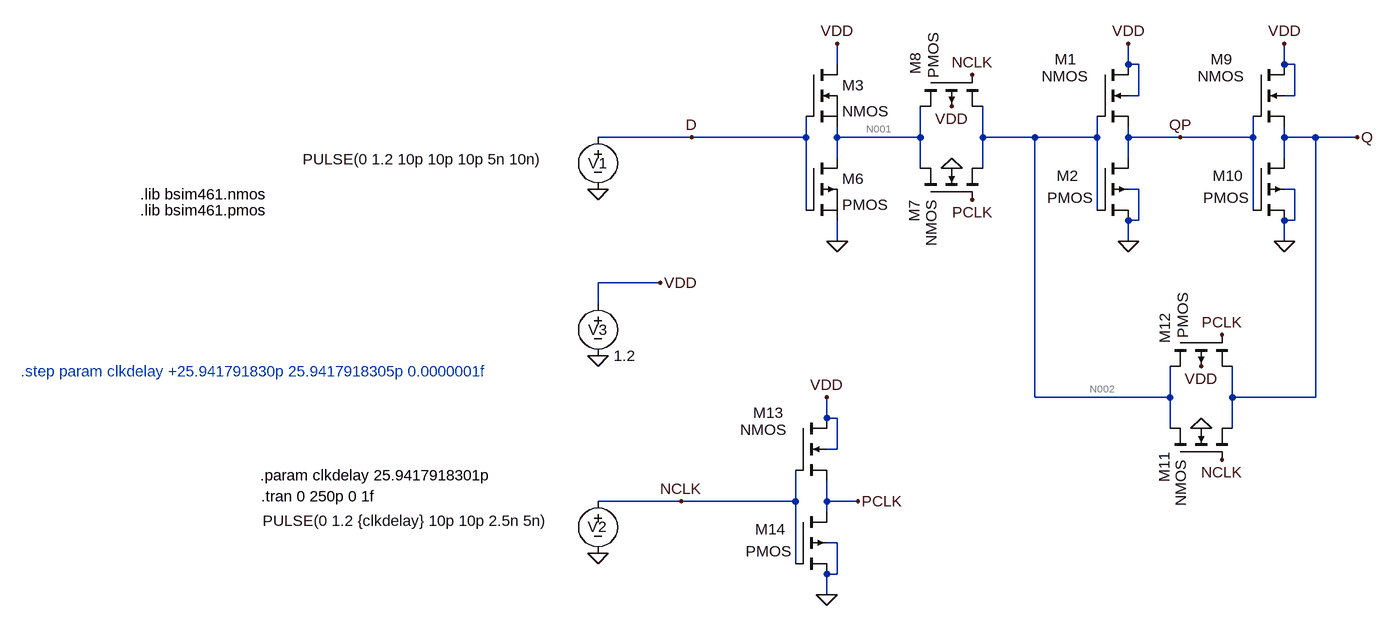
[diagram p0: schematic Draft2.asc]
Draft2.asc, the LTspice schematic file:
Version 4
SHEET 1 880 936
WIRE -560 80 -560 48
WIRE -112 80 -112 48
WIRE -96 80 -112 80
WIRE 128 80 128 48
WIRE 144 80 128 80
WIRE -96 128 -96 80
WIRE -96 128 -112 128
WIRE 144 128 144 80
WIRE 144 128 128 128
WIRE -784 192 -928 192
WIRE -608 192 -608 160
WIRE -608 192 -784 192
WIRE -560 192 -560 176
WIRE -432 192 -432 144
WIRE -432 192 -560 192
WIRE -336 192 -336 144
WIRE -256 192 -336 192
WIRE -160 192 -160 160
WIRE -160 192 -256 192
WIRE -112 192 -112 176
WIRE -32 192 -112 192
WIRE 80 192 80 160
WIRE 80 192 -32 192
WIRE 128 192 128 176
WIRE 176 192 128 192
WIRE 240 192 176 192
WIRE -560 224 -560 192
WIRE -112 224 -112 192
WIRE 128 224 128 192
WIRE -432 240 -432 192
WIRE -336 240 -336 192
WIRE -96 272 -112 272
WIRE 144 272 128 272
WIRE -608 304 -608 192
WIRE -160 304 -160 192
WIRE 80 304 80 192
WIRE -96 320 -96 272
WIRE -96 320 -112 320
WIRE 144 320 144 272
WIRE 144 320 128 320
WIRE -560 352 -560 320
WIRE -112 352 -112 320
WIRE 128 352 128 320
WIRE -832 416 -928 416
WIRE -928 448 -928 416
WIRE -256 592 -256 192
WIRE -48 592 -48 544
WIRE -48 592 -256 592
WIRE 48 592 48 544
WIRE 176 592 176 192
WIRE 176 592 48 592
WIRE -576 624 -576 592
WIRE -560 624 -576 624
WIRE -48 640 -48 592
WIRE 48 640 48 592
WIRE -560 672 -560 624
WIRE -560 672 -576 672
WIRE -800 752 -928 752
WIRE -624 752 -624 704
WIRE -624 752 -800 752
WIRE -576 752 -576 720
WIRE -528 752 -576 752
WIRE -576 768 -576 752
WIRE -560 816 -576 816
WIRE -624 848 -624 752
WIRE -560 864 -560 816
WIRE -560 864 -576 864
WIRE -576 896 -576 864
FLAG -112 48 VDD
FLAG -112 352 0
FLAG -560 48 VDD
FLAG -560 352 0
FLAG -384 144 VDD
FLAG -384 240 0
FLAG -352 288 PCLK
FLAG -352 96 NCLK
FLAG 128 48 VDD
FLAG 128 352 0
FLAG -32 192 QP
FLAG 0 544 VDD
FLAG 0 640 0
FLAG 32 688 NCLK
FLAG 32 496 PCLK
FLAG -576 592 VDD
FLAG -576 896 0
FLAG -928 272 0
FLAG -928 832 0
FLAG -528 752 PCLK
FLAG -800 752 NCLK
FLAG -784 192 D
FLAG -928 528 0
FLAG -832 416 VDD
FLAG 240 192 Q
SYMBOL nmos4 -160 80 R0
WINDOW 0 -65 -8 Left 2
WINDOW 3 -85 18 Left 2
SYMATTR InstName M1
SYMATTR Value2 l=20n w=20n
SYMBOL pmos4 -160 224 R0
WINDOW 0 -62 27 Left 2
WINDOW 3 -77 61 Left 2
SYMATTR InstName M2
SYMATTR Value2 l=20n w=50n
SYMBOL nmos4 -432 288 R270
WINDOW 0 -35 -9 Left 2
WINDOW 3 -72 17 Left 2
SYMATTR InstName M7
SYMATTR Value2 l=20n w=20n
SYMBOL pmos4 -432 96 M90
WINDOW 0 -34 -8 Left 2
WINDOW 3 -65 20 Left 2
SYMATTR InstName M8
SYMATTR Value2 l=20n w=50n
SYMBOL nmos4 80 80 R0
WINDOW 0 -65 -8 Left 2
WINDOW 3 -85 18 Left 2
SYMATTR InstName M9
SYMATTR Value2 l=20n w=20n
SYMBOL pmos4 80 224 R0
WINDOW 0 -62 27 Left 2
WINDOW 3 -77 61 Left 2
SYMATTR InstName M10
SYMATTR Value2 l=20n w=50n
SYMBOL nmos4 -48 688 R270
WINDOW 0 -35 -9 Left 2
WINDOW 3 -72 17 Left 2
SYMATTR InstName M11
SYMATTR Value2 l=20n w=20n
SYMBOL pmos4 -48 496 M90
WINDOW 0 -34 -8 Left 2
WINDOW 3 -65 20 Left 2
SYMATTR InstName M12
SYMATTR Value2 l=20n w=50n
SYMBOL nmos4 -624 624 R0
WINDOW 0 -65 -8 Left 2
WINDOW 3 -85 18 Left 2
SYMATTR InstName M13
SYMATTR Value2 l=20n w=20n
SYMBOL pmos4 -624 768 R0
WINDOW 0 -62 27 Left 2
WINDOW 3 -77 61 Left 2
SYMATTR InstName M14
SYMATTR Value2 l=20n w=50n
SYMBOL voltage -928 176 R0
WINDOW 0 -15 56 Left 2
WINDOW 3 -454 50 Left 2
WINDOW 123 0 0 Left 0
WINDOW 39 0 0 Left 0
SYMATTR InstName V1
SYMATTR Value PULSE(0 1.2 10p 10p 10p 5n 10n)
SYMBOL voltage -928 736 R0
WINDOW 0 -16 55 Left 2
WINDOW 3 -516 46 Left 2
WINDOW 123 0 0 Left 0
WINDOW 39 0 0 Left 0
SYMATTR InstName V2
SYMATTR Value PULSE(0 1.2 {clkdelay} 10p 10p 2.5n 5n)
SYMBOL voltage -928 432 R0
WINDOW 0 -15 56 Left 2
WINDOW 123 0 0 Left 0
WINDOW 39 0 0 Left 0
SYMATTR InstName V3
SYMATTR Value 1.2
SYMBOL nmos -608 80 R0
SYMATTR InstName M3
SYMBOL pmos -608 224 R0
SYMATTR InstName M6
TEXT -1448 712 Left 2 !.param clkdelay 25.9417918301p
TEXT -1446 744 Left 2 !.tran 0 250p 0 1f
TEXT -1816 552 Left 2 ;.step param clkdelay +25.941791830p 25.9417918305p 0.0000001f
TEXT -1632 280 Left 2 !.lib bsim461.nmos
TEXT -1632 304 Left 2 !.lib bsim461.pmos

The netlist it stands for:
* Draft2.asc
M1 VDD N002 QP VDD NMOS l=20n w=20n
M2 QP N002 0 0 PMOS l=20n w=50n
M7 N001 PCLK N002 0 NMOS l=20n w=20n
M8 N001 NCLK N002 VDD PMOS l=20n w=50n
M9 VDD QP Q VDD NMOS l=20n w=20n
M10 Q QP 0 0 PMOS l=20n w=50n
M11 N002 NCLK Q 0 NMOS l=20n w=20n
M12 N002 PCLK Q VDD PMOS l=20n w=50n
M13 VDD NCLK PCLK VDD NMOS l=20n w=20n
M14 PCLK NCLK 0 0 PMOS l=20n w=50n
V1 D 0 PULSE(0 1.2 10p 10p 10p 5n 10n)
V2 NCLK 0 PULSE(0 1.2 {clkdelay} 10p 10p 2.5n 5n)
V3 VDD 0 1.2
M3 VDD D N001 N001 NMOS
M6 N001 D 0 0 PMOS
.model NMOS NMOS
.model PMOS PMOS
.lib standard.mos
.param clkdelay 25.9417918301p
.tran 0 250p 0 1f
* .step param clkdelay +25.941791830p 25.9417918305p 0.0000001f
.lib bsim461.nmos
.lib bsim461.pmos
.backanno
.end

* Results of the author's LTspice run, read from the files saved beside the schematic
* Operating Point, zero values left out:
*   V(vdd) = 1.2 V
*   V(n002) = 1.765 mV
*   V(qp) = 599 mV
*   V(n001) = 1.763 mV
*   V(pclk) = 599 mV
*   V(q) = 600 mV
*   Id(M6) = 31.08 pA
*   Is(M6) = -31.08 pA
*   Id(M14) = 123.3 µA
*   Ib(M14) = -114.3 µA
*   Is(M14) = -8.971 µA
*   Id(M12) = -25.67 pA
*   Ib(M12) = 1.818 pA
*   Is(M12) = 23.85 pA
*   Id(M10) = 118.7 µA
*   Ib(M10) = -118.7 µA
*   Is(M10) = -24.18 pA
*   Id(M8) = -1.41 pA
*   Ib(M8) = 2.416 pA
*   Is(M8) = -1.007 pA
*   Id(M2) = 123.3 µA
*   Ib(M2) = -114.3 µA
*   Is(M2) = -8.918 µA
*   Id(M3) = 2.406 pA
*   Ib(M3) = -1.208 pA
*   Is(M3) = -1.198 pA
*   Ib(M13) = 123.3 µA
*   Is(M13) = -123.3 µA
*   Is(M11) = 1.208 pA
*   Ib(M9) = 118.7 µA
*   Is(M9) = -118.7 µA
*   Id(M7) = -27.27 pA
*   Is(M7) = 27.27 pA
*   Ib(M1) = 123.3 µA
*   Is(M1) = -123.3 µA
*   I(V3) = -365.3 µA
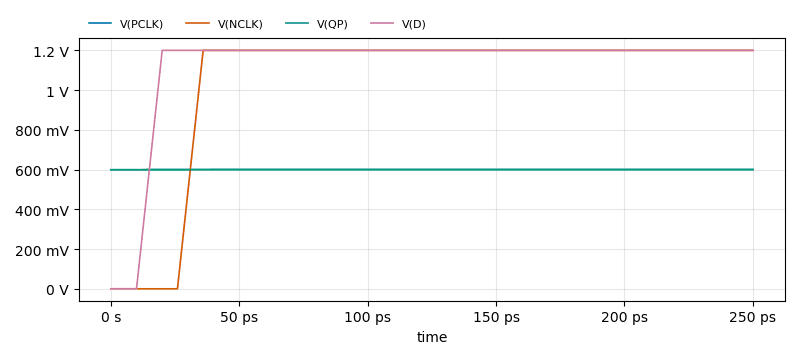
[diagram p1: Transient Analysis of Draft2.asc, plotted from the saved traces]
* Transient Analysis, 1 run:
*   V(PCLK): min 599 mV, max 600.4 mV, average 600.2 mV, rms 600.2 mV, last 600.4 mV
*   V(NCLK): min 0 V, max 1.2 V, average 1.051 V, rms 1.119 V, last 1.2 V
*   V(QP): min 599 mV, max 600 mV, average 600 mV, rms 600 mV, last 600 mV
*   V(D): min 0 V, max 1.2 V, average 1.128 V, rms 1.159 V, last 1.2 V